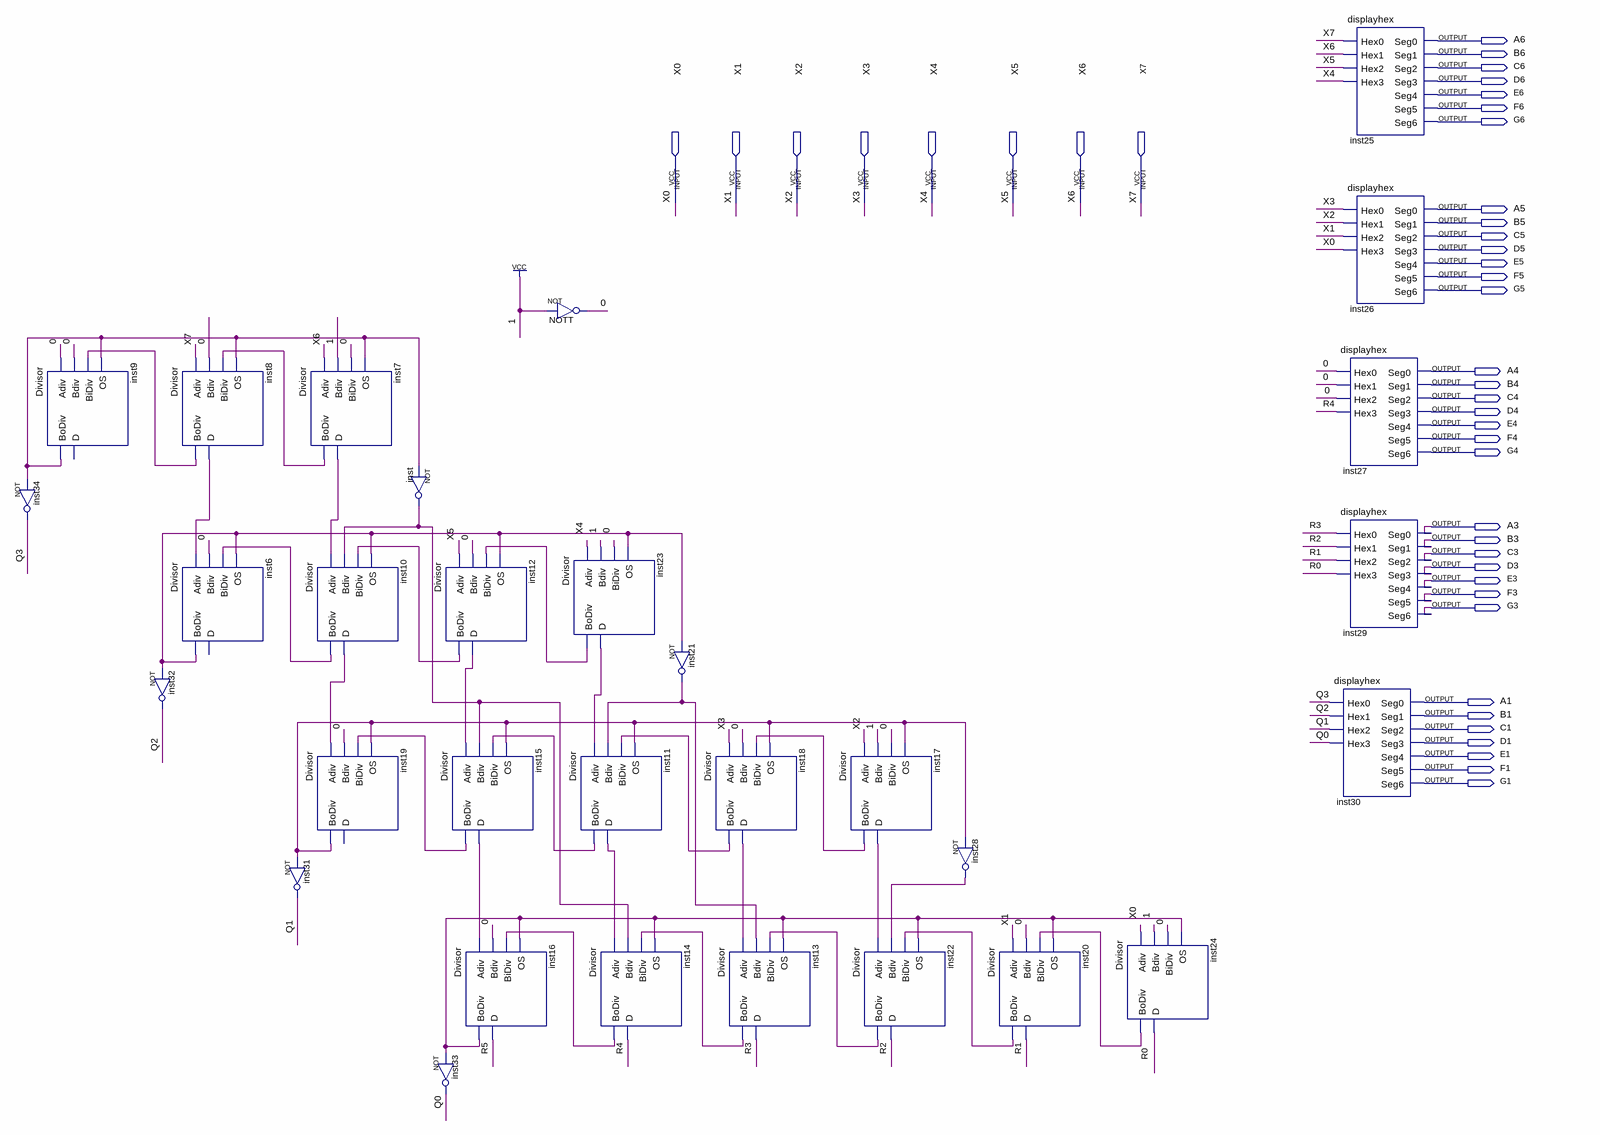
[diagram p0: schematic sheet]
// Quartus schematic aula12.bdf as structural Verilog: 31 symbols, 43 pins
module aula12 (
  input  X0,
  input  X1,
  input  X2,
  input  X3,
  input  X4,
  input  X5,
  input  X6,
  input  X7,
  output A6,
  output B6,
  output C6,
  output D6,
  output E6,
  output F6,
  output G6,
  output A5,
  output B5,
  output C5,
  output D5,
  output E5,
  output F5,
  output G5,
  output A4,
  output B4,
  output C4,
  output D4,
  output E4,
  output F4,
  output G4,
  output A3,
  output B3,
  output C3,
  output D3,
  output E3,
  output F3,
  output G3,
  output A1,
  output B1,
  output C1,
  output D1,
  output E1,
  output F1,
  output G1
);

  wire \0 , inst6_bodiv, inst7_bodiv, inst7_d, inst8_bodiv, inst8_d, inst9_bodiv, inst10_bodiv, inst10_d,
       inst11_bodiv, inst11_d, inst12_bodiv, inst12_d, inst13_bodiv, inst14_bodiv, inst15_bodiv, inst15_d,
       inst16_bodiv, inst17_bodiv, inst17_d, inst18_bodiv, inst18_d, inst19_bodiv, inst20_bodiv, inst21_out,
       inst22_bodiv, inst23_bodiv, inst23_d, inst24_bodiv, inst28_out, inst_out, Q0, Q1, Q2, Q3, R0, R1, R2,
       R3, R4, R5;

  Divisor inst9 (.Adiv(\0 ), .Bdiv(\0 ), .BiDiv(inst8_bodiv), .OS(inst9_bodiv), .BoDiv(inst9_bodiv));  // open: D
  not inst34 (Q3, inst9_bodiv);
  not inst32 (Q2, inst6_bodiv);
  Divisor inst8 (.Adiv(X7), .Bdiv(\0 ), .BiDiv(inst7_bodiv), .OS(inst9_bodiv), .BoDiv(inst8_bodiv), .D(inst8_d));
  Divisor inst6 (.Adiv(inst8_d), .Bdiv(\0 ), .BiDiv(inst10_bodiv), .OS(inst6_bodiv), .BoDiv(inst6_bodiv));  // open: D
  Divisor inst7 (.Adiv(X6), .Bdiv(1'b1), .BiDiv(\0 ), .OS(inst9_bodiv), .BoDiv(inst7_bodiv), .D(inst7_d));
  Divisor inst10 (
    .Adiv(inst7_d), .Bdiv(inst_out), .BiDiv(inst12_bodiv), .OS(inst6_bodiv), .BoDiv(inst10_bodiv),
    .D(inst10_d));
  Divisor inst19 (
    .Adiv(inst10_d), .Bdiv(\0 ), .BiDiv(inst15_bodiv), .OS(inst19_bodiv), .BoDiv(inst19_bodiv));  // open: D
  not inst31 (Q1, inst19_bodiv);
  not inst (inst_out, inst9_bodiv);
  Divisor inst12 (.Adiv(X5), .Bdiv(\0 ), .BiDiv(inst23_bodiv), .OS(inst6_bodiv), .BoDiv(inst12_bodiv), .D(inst12_d));
  Divisor inst15 (
    .Adiv(inst12_d), .Bdiv(inst_out), .BiDiv(inst11_bodiv), .OS(inst19_bodiv), .BoDiv(inst15_bodiv),
    .D(inst15_d));
  Divisor inst16 (.Adiv(inst15_d), .Bdiv(\0 ), .BiDiv(inst14_bodiv), .OS(inst16_bodiv), .BoDiv(inst16_bodiv), .D(R5));
  not inst33 (Q0, inst16_bodiv);
  not NOTT (\0 , 1'b1);
  Divisor inst23 (.Adiv(X4), .Bdiv(1'b1), .BiDiv(\0 ), .OS(inst6_bodiv), .BoDiv(inst23_bodiv), .D(inst23_d));
  Divisor inst11 (
    .Adiv(inst23_d), .Bdiv(inst21_out), .BiDiv(inst18_bodiv), .OS(inst19_bodiv), .BoDiv(inst11_bodiv),
    .D(inst11_d));
  Divisor inst14 (
    .Adiv(inst11_d), .Bdiv(inst_out), .BiDiv(inst13_bodiv), .OS(inst16_bodiv), .BoDiv(inst14_bodiv), .D(R4));
  not inst21 (inst21_out, inst6_bodiv);
  Divisor inst18 (.Adiv(X3), .Bdiv(\0 ), .BiDiv(inst17_bodiv), .OS(inst19_bodiv), .BoDiv(inst18_bodiv), .D(inst18_d));
  Divisor inst13 (
    .Adiv(inst18_d), .Bdiv(inst21_out), .BiDiv(inst22_bodiv), .OS(inst16_bodiv), .BoDiv(inst13_bodiv), .D(R3));
  Divisor inst17 (.Adiv(X2), .Bdiv(1'b1), .BiDiv(\0 ), .OS(inst19_bodiv), .BoDiv(inst17_bodiv), .D(inst17_d));
  Divisor inst22 (
    .Adiv(inst17_d), .Bdiv(inst28_out), .BiDiv(inst20_bodiv), .OS(inst16_bodiv), .BoDiv(inst22_bodiv), .D(R2));
  not inst28 (inst28_out, inst19_bodiv);
  Divisor inst20 (.Adiv(X1), .Bdiv(\0 ), .BiDiv(inst24_bodiv), .OS(inst16_bodiv), .BoDiv(inst20_bodiv), .D(R1));
  Divisor inst24 (.Adiv(X0), .Bdiv(1'b1), .BiDiv(\0 ), .OS(inst16_bodiv), .BoDiv(inst24_bodiv), .D(R0));
  displayhex inst27 (
    .Hex0(\0 ), .Hex1(\0 ), .Hex2(\0 ), .Hex3(R4), .Seg0(A4), .Seg1(B4), .Seg2(C4), .Seg3(D4), .Seg4(E4),
    .Seg5(F4), .Seg6(G4));
  displayhex inst29 (
    .Hex0(R3), .Hex1(R2), .Hex2(R1), .Hex3(R0), .Seg0(A3), .Seg1(B3), .Seg2(C3), .Seg3(D3), .Seg4(E3),
    .Seg5(F3), .Seg6(G3));
  displayhex inst30 (
    .Hex0(Q3), .Hex1(Q2), .Hex2(Q1), .Hex3(Q0), .Seg0(A1), .Seg1(B1), .Seg2(C1), .Seg3(D1), .Seg4(E1),
    .Seg5(F1), .Seg6(G1));
  displayhex inst25 (
    .Hex0(X7), .Hex1(X6), .Hex2(X5), .Hex3(X4), .Seg0(A6), .Seg1(B6), .Seg2(C6), .Seg3(D6), .Seg4(E6),
    .Seg5(F6), .Seg6(G6));
  displayhex inst26 (
    .Hex0(X3), .Hex1(X2), .Hex2(X1), .Hex3(X0), .Seg0(A5), .Seg1(B5), .Seg2(C5), .Seg3(D5), .Seg4(E5),
    .Seg5(F5), .Seg6(G5));
endmodule
